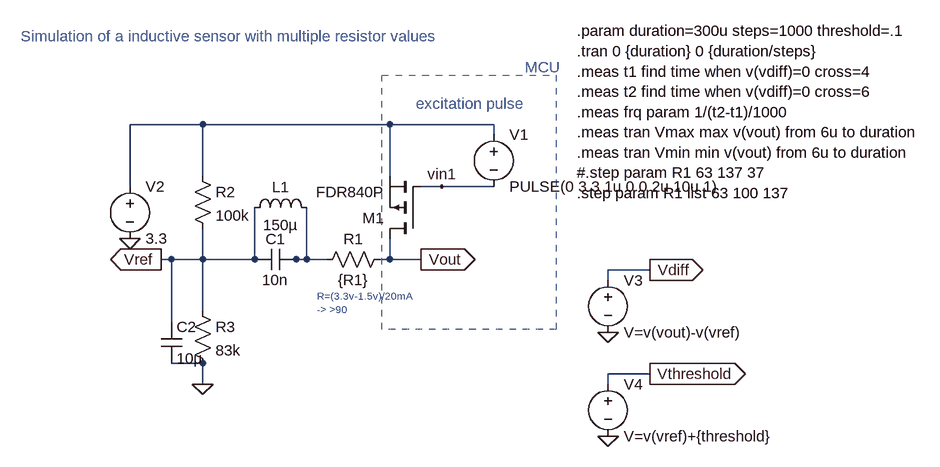
[diagram p0: schematic inductive-sensor-nofet.asc]
inductive-sensor-nofet.asc, the LTspice schematic file:
Version 4
SHEET 1 1384 680
WIRE 224 144 112 144
WIRE 512 144 224 144
WIRE 672 144 512 144
WIRE 672 160 672 144
WIRE 224 224 224 144
WIRE 512 224 512 144
WIRE 112 240 112 144
WIRE 592 240 560 240
WIRE 672 240 592 240
WIRE 176 352 160 352
WIRE 224 352 224 304
WIRE 224 352 176 352
WIRE 304 352 304 272
WIRE 304 352 224 352
WIRE 368 352 352 352
WIRE 384 352 384 272
WIRE 384 352 368 352
WIRE 416 352 384 352
WIRE 512 352 512 320
WIRE 512 352 496 352
WIRE 560 352 512 352
WIRE 912 368 848 368
WIRE 848 384 848 368
WIRE 224 432 224 352
WIRE 176 448 176 352
WIRE 224 512 176 512
WIRE 912 528 848 528
WIRE 224 544 224 512
WIRE 848 544 848 528
FLAG 560 352 Vout
IOPIN 560 352 Out
FLAG 592 240 vin1
FLAG 112 320 0
FLAG 224 544 0
FLAG 848 464 0
FLAG 160 352 Vref
IOPIN 160 352 Out
FLAG 912 368 Vdiff
IOPIN 912 368 Out
FLAG 848 624 0
FLAG 912 528 Vthreshold
IOPIN 912 528 Out
SYMBOL Cap 368 336 R90
WINDOW 0 0 32 VBottom 2
WINDOW 3 32 32 VTop 2
SYMATTR InstName C1
SYMATTR Value 10n
SYMATTR SpiceLine Rser=.141
SYMBOL ind 288 288 R270
WINDOW 0 32 56 VTop 2
WINDOW 3 5 56 VBottom 2
SYMATTR InstName L1
SYMATTR Value 150µ
SYMATTR SpiceLine Rser=.54
SYMBOL voltage 672 144 R0
SYMATTR InstName V1
SYMATTR Value PULSE(0 3.3 1u 0 0 2u 10u 1)
SYMBOL pmos 560 320 R180
SYMATTR InstName M1
SYMATTR Value FDR840P
SYMBOL Res 512 336 R90
WINDOW 0 0 56 VBottom 2
WINDOW 3 32 56 VTop 2
SYMATTR InstName R1
SYMATTR Value {R1}
SYMBOL Voltage 112 224 R0
SYMATTR InstName V2
SYMATTR Value 3.3
SYMBOL Res 208 208 R0
SYMATTR InstName R2
SYMATTR Value 100k
SYMBOL Res 208 416 R0
SYMATTR InstName R3
SYMATTR Value 83k
SYMBOL Cap 160 448 R0
SYMATTR InstName C2
SYMATTR Value 10µ
SYMBOL Voltage 848 368 R0
SYMATTR InstName V3
SYMATTR Value V=v(vout)-v(vref)
SYMATTR Prefix B
SYMBOL Voltage 848 528 R0
SYMATTR InstName V4
SYMATTR Value V=v(vref)+{threshold}
SYMATTR Prefix B
TEXT 800 0 Left 2 !.param duration=300u steps=1000 threshold=.1\n.tran 0 {duration} 0 {duration/steps}\n.meas t1 find time when v(vdiff)=0 cross=4\n.meas t2 find time when v(vdiff)=0 cross=6\n.meas frq param 1/(t2-t1)/1000\n.meas tran Vmax max v(vout) from 6u to duration\n.meas tran Vmin min v(vout) from 6u to duration\n#.step param R1 63 137 37\n.step param R1 list 63 100 137
TEXT 400 408 Left 1 ;R=(3.3v-1.5v)/20mA\n-> >90
TEXT 552 112 Left 2 ;excitation pulse
TEXT 720 56 Left 2 ;MCU
TEXT -56 8 Left 2 ;Simulation of a inductive sensor with multiple resistor values
RECTANGLE Normal 500 68 768 460 2

The netlist it stands for:
* inductive-sensor-nofet.asc
C1 N002 Vref 10n Rser=.141
L1 Vref N002 150µ Rser=.54
V1 N001 vin1 PULSE(0 3.3 1u 0 0 2u 10u 1)
M1 Vout vin1 N001 N001 FDR840P
R1 Vout N002 {R1}
V2 N001 0 3.3
R2 N001 Vref 100k
R3 Vref 0 83k
C2 Vref 0 10µ
B§V3 Vdiff 0 V=v(vout)-v(vref)
B§V4 Vthreshold 0 V=v(vref)+{threshold}
.model NMOS NMOS
.model PMOS PMOS
.lib standard.mos
.param duration=300u steps=1000 threshold=.1
.tran 0 {duration} 0 {duration/steps}
.meas t1 find time when v(vdiff)=0 cross=4
.meas t2 find time when v(vdiff)=0 cross=6
.meas frq param 1/(t2-t1)/1000
.meas tran Vmax max v(vout) from 6u to duration
.meas tran Vmin min v(vout) from 6u to duration
#.step param R1 63 137 37
.step param R1 list 63 100 137
* R=(3.3v-1.5v)/20mA
* -> >90
* excitation pulse
* MCU
* Simulation of a inductive sensor with multiple resistor values
.backanno
.end